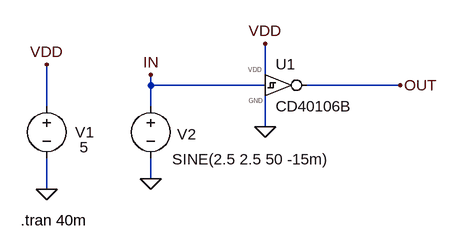
[diagram p0: schematic NOT_CD40106.asc]
NOT_CD40106.asc, the LTspice schematic file:
Version 4.1
SHEET 1 880 680
WIRE 256 272 256 224
WIRE 80 288 80 272
WIRE 256 288 80 288
WIRE 464 288 320 288
WIRE -80 320 -80 256
WIRE 80 320 80 288
WIRE 256 352 256 304
WIRE 80 432 80 400
WIRE -80 448 -80 400
FLAG 464 288 OUT
FLAG -80 448 0
FLAG -80 256 VDD
FLAG 256 224 VDD
FLAG 256 352 0
FLAG 80 432 0
FLAG 80 272 IN
SYMBOL voltage -80 304 R0
WINDOW 123 0 0 Left 0
WINDOW 39 0 0 Left 0
WINDOW 0 44 56 Left 2
WINDOW 3 51 79 Left 2
SYMATTR InstName V1
SYMATTR Value 5
SYMBOL voltage 80 304 R0
WINDOW 0 41 59 Left 2
WINDOW 3 33 98 Left 2
WINDOW 123 0 0 Left 0
WINDOW 39 0 0 Left 0
SYMATTR InstName V2
SYMATTR Value SINE(2.5 2.5 50 -15m)
SYMBOL MyLib\\Digital\\NOT_CD40106B 256 256 R0
SYMATTR InstName U1
SYMATTR SpiceLine vdd={5}
TEXT -120 496 Left 2 !.tran 40m

The netlist it stands for:
* NOT_CD40106.asc
V1 VDD 0 5
V2 IN 0 SINE(2.5 2.5 50 -15m)
X§U1 IN OUT VDD 0 CD40106B vdd={5}  ; pins in out VDD GND
.tran 40m
.lib MyLib/Digital/NOT_CD40106B.lib
.backanno
.end

* Results of the author's LTspice run, read from the files saved beside the schematic
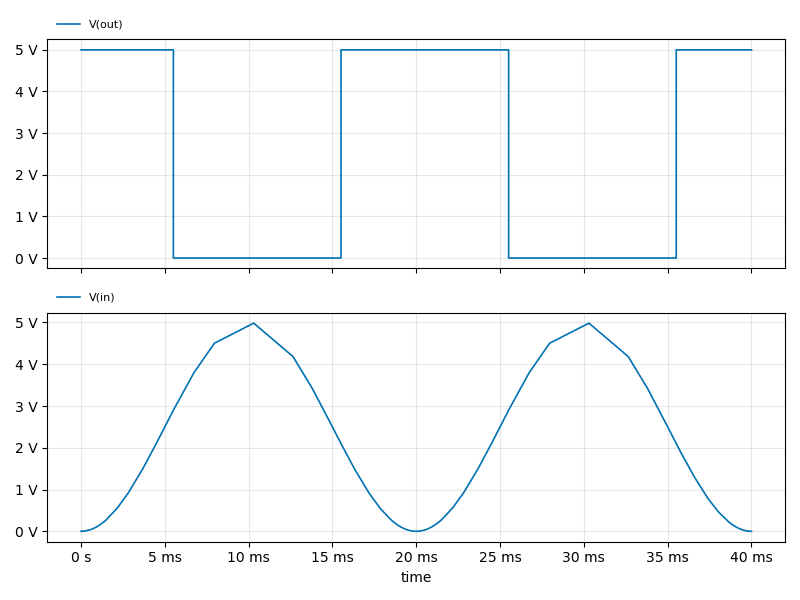
[diagram p1: Transient Analysis of NOT_CD40106.asc, plotted from the saved traces]
* Transient Analysis, 1 run:
*   V(out): min 0 V, max 5 V, average 2.5 V, rms 3.536 V, last 5 V
*   V(in): min 0 V, max 4.984 V, average 2.474 V, rms 3.03 V, last 0 V